# EAGLE design Grove I2C FM Receiver v1.0 (EAGLE 6.4)
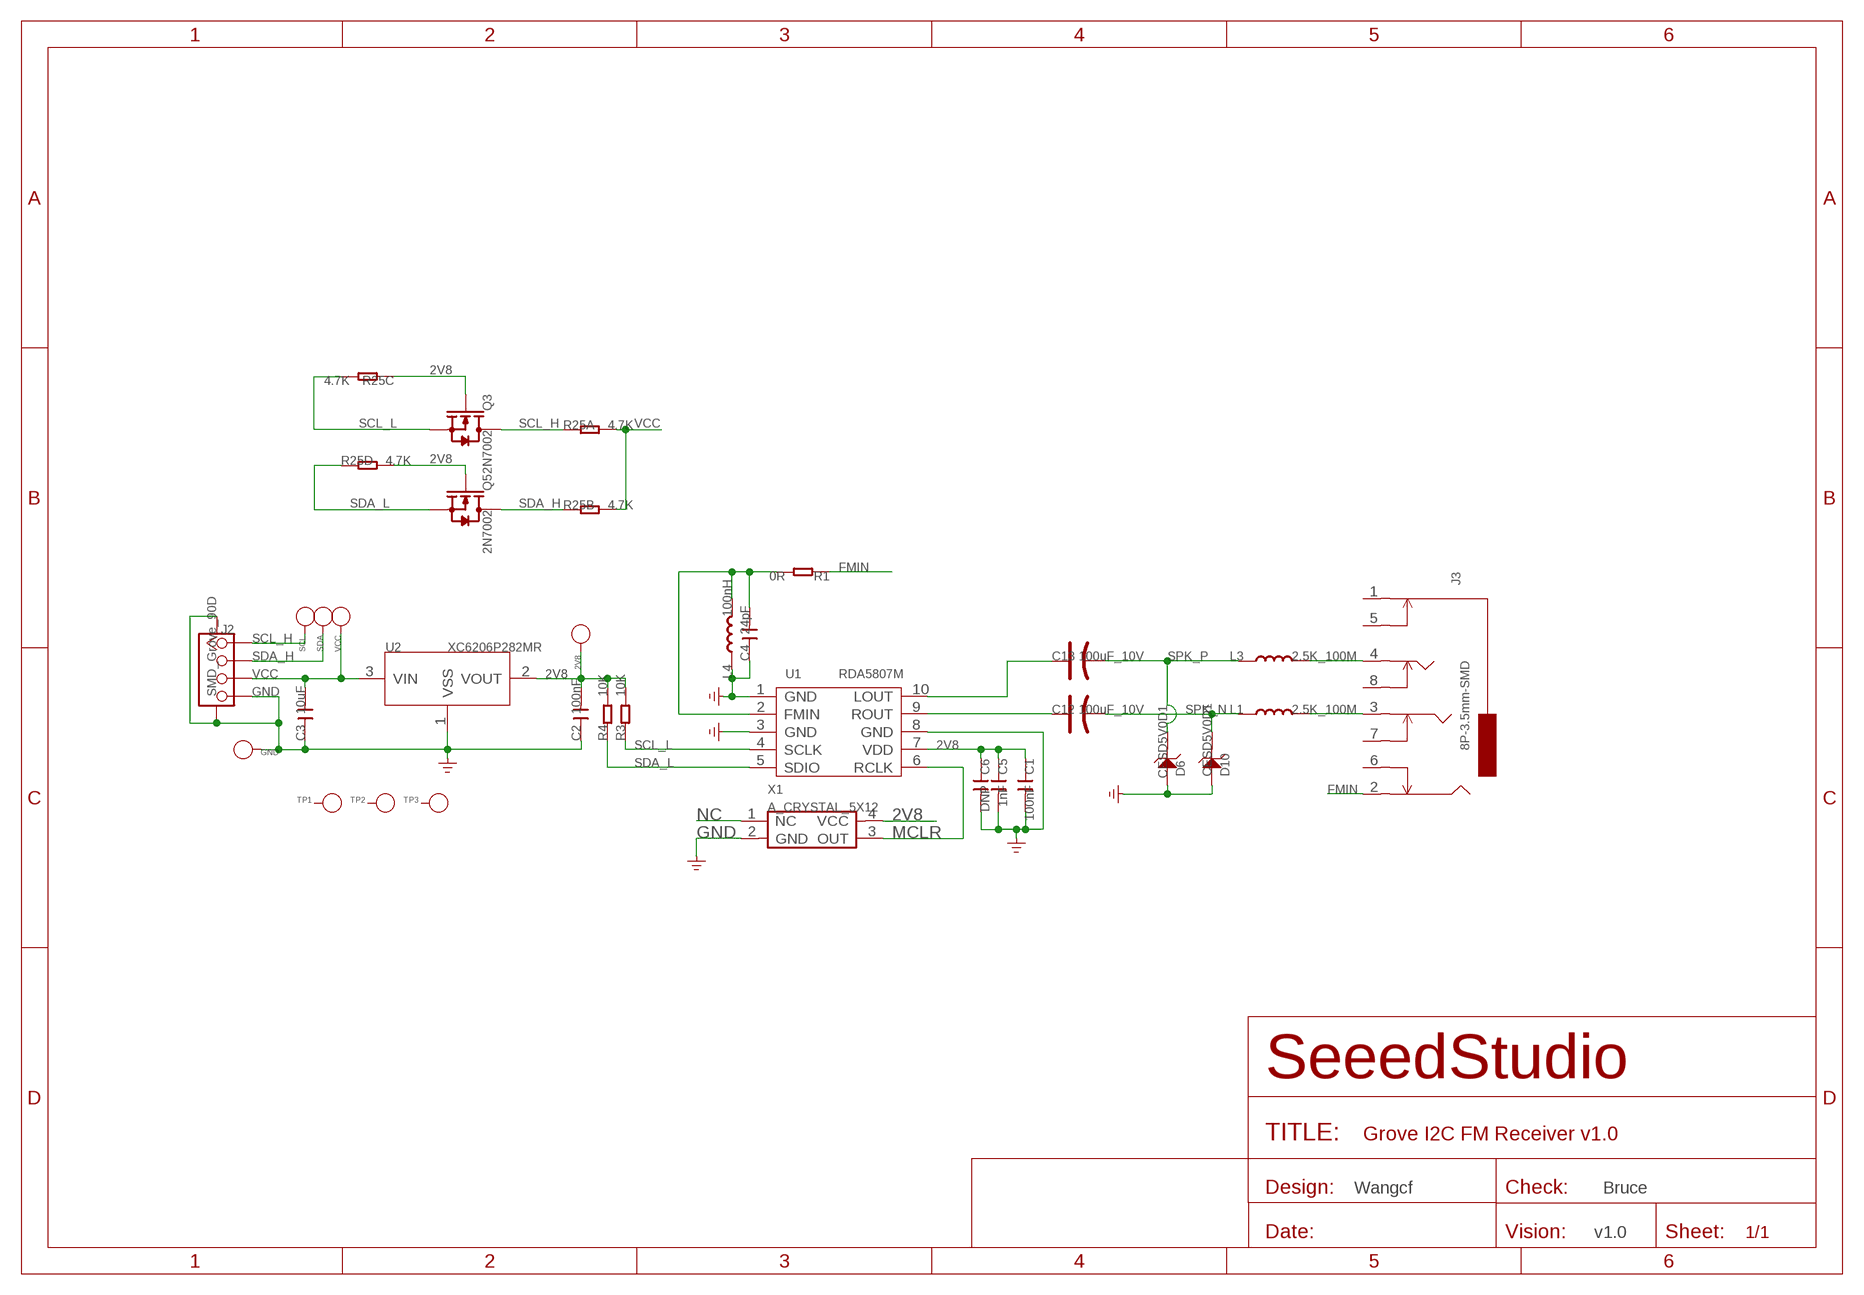
[diagram p0: schematic, sheet 1]

## Parts
2V8  PAD-TEST-POINT'4545'  [TP_4545]
C1  100nF  C-0603  [C0603]
C2  100nF  C-0603  [C0603]
C3  10uF  C-0805  [C0805]
C4  24pF  C-0603  [C0603]
C5  1nF  C-0603  [C0603]
C6  DNP  C-0603  [C0603]
C12  100uF_10V  CAP-AVX-B  [AVX-B]
C13  100uF_10V  CAP-AVX-B  [AVX-B]
D6  CESD5V0D1  D-ESD  [SOD123-2.7X1.6]
D10  CESD5V0D1  D-ESD  [SOD123-2.7X1.6]
GND  PAD-TEST-POINT'4545'  [TP_4545]
J2  SMD_Grove_90D  TWIG-4P-2.0-SMD-FEMALE-REINFORCE'DD'  [4P-SMD-2.0]
J3  8P-3.5mm-SMD  AUDIO-8P'PJ-3536-L6S'  [8P-3.5-SMD]
L1  2.5K_100M  L'0603'  [L0603]
L3  2.5K_100M  L'0603'  [L0603]
L4  100nH  L'0603'  [L0603]
Q3  2N7002  MOSFET-N'SOT23'  [SOT23]
Q5  2N7002  MOSFET-N'SOT23'  [SOT23]
R1  0R  R-0603  [R0603]
R3  10K  R-0603  [R0603]
R4  10K  R-0603  [R0603]
R25  4.7K  R-4R-1206  [1206-8-3.3X2.4]
SCL  PAD-TEST-POINT'4545'  [TP_4545]
SDA  PAD-TEST-POINT'4545'  [TP_4545]
TP1  PAD-TEST-POINT'4545'  [TP_4545]
TP2  PAD-TEST-POINT'4545'  [TP_4545]
TP3  PAD-TEST-POINT'4545'  [TP_4545]
U1  RDA5807M  [MSOP10]
U2  XC6206P282MR  XC6206MR  [SOT23]
VCC  PAD-TEST-POINT'4545'  [TP_4545]
X1  A_CRYSTAL_5X12  [4P_5X12]

## Nets
2V8: 2V8.T C1.1 C2.2 C5.1 C6.1 Q3.1(G) Q5.1(G) R3.2 R4.2 R25.3 R25.5 U1.7(VDD) U2.2(VOUT) X1.4(VCC)
FMIN: J3.2 R1.1
FMIN1: C4.2 L4.2 R1.2 U1.2(FMIN)
GND: C1.2 C2.1 C3.1 C4.1 C5.2 C6.2 D6.1 D10.1 GND.T J2.4 J2.SS1 J2.SS2 L4.1 U1.1(GND) U1.3(GND) U1.8(GND) U2.1(VSS) X1.2(GND)
MCLR: U1.6(RCLK) X1.3(OUT)
N$2: C12.+ U1.9(ROUT)
N$4: C13.+ U1.10(LOUT)
N$5: J3.4 L3.2
N$6: J3.3 L1.2
NC: X1.1(NC)
SCL_H: J2.1 Q3.3(D) R25.1 SCL.T
SCL_L: Q3.2(S) R3.1 R25.6 U1.4(SCLK)
SDA_H: J2.2 Q5.3(D) R25.2 SDA.T
SDA_L: Q5.2(S) R4.1 R25.4 U1.5(SDIO)
SPK_N: C12.- D10.2 L1.1
SPK_P: C13.- D6.2 L3.1
VCC: C3.2 J2.3 R25.7 R25.8 U2.3(VIN) VCC.T
Unconnected: J3.1 J3.5 J3.6 J3.7 J3.8 TP1.T TP2.T TP3.T

## Notes on the sheet
- Wangcf | Bruce
- v1.0

## Library data of the parts
2V8 GND SCL SDA TP1-TP3 VCC = Discrete:PAD-TEST-POINT; PARTNO: DNP
C1-C6 = Discrete:C*: Ceramic Capacitors
C12 C13 = Discrete:CAP*: Electrolytic Capacitors,Tantalum Capacitors and Super Capacitors
D6 D10 = template:D-ESD: Diodes for Protectiong against ESD
J2 = Connector :TWIG-4P-2.0-SMD-FEMALE-REINFORCE
J3 = template:AUDIO-8P
L1 L3 L4 = Discrete:L*
Q3 Q5 = Discrete:MOSFET-N: IRLL014: http://www.vishay.com/docs/91319/sihll014.pdf
R1 R3 R4 = Discrete:R*
R25 = Discrete:R-4R*: Resistor Array
U1 = template:RDA5807M: SINGLE-CHIP BROADCAST FM RADIO TUNER
U2 = IC:XC6206: LOW ESR Cap.Compatible Positive Voltage Regulators
X1 = CPT_SMD:A_CRYSTAL

## Net classes
0 default: width 0.152 mm, drill 0.305 mm, clearance 0.152 mm

## Board
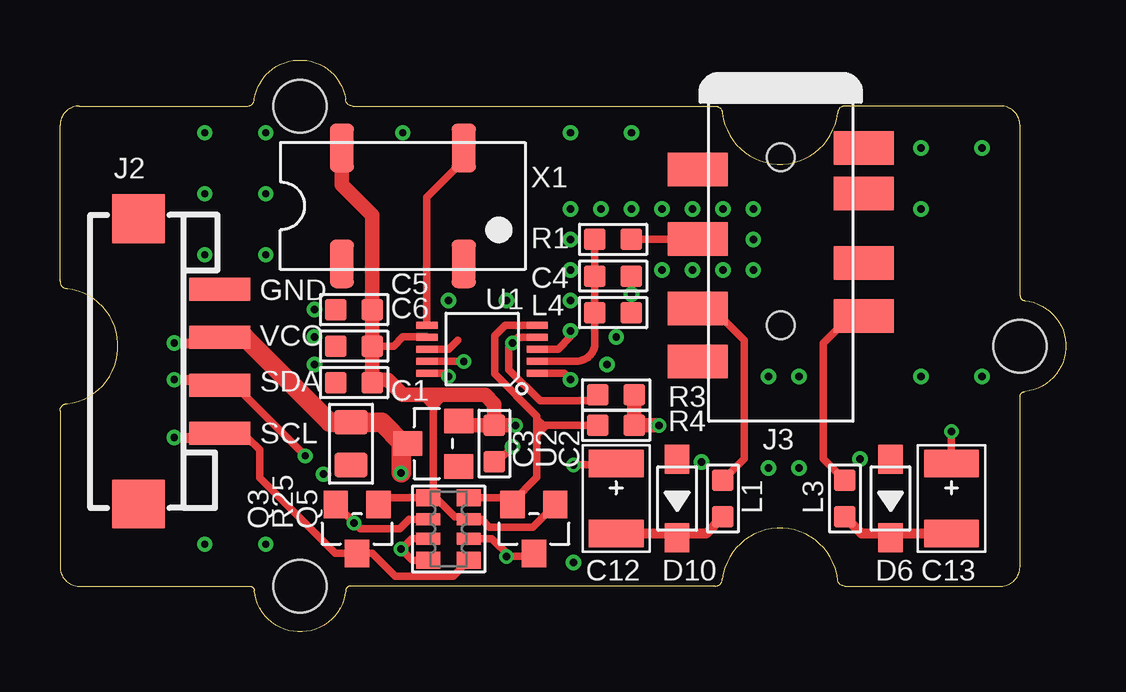
[diagram p1: board, top side]
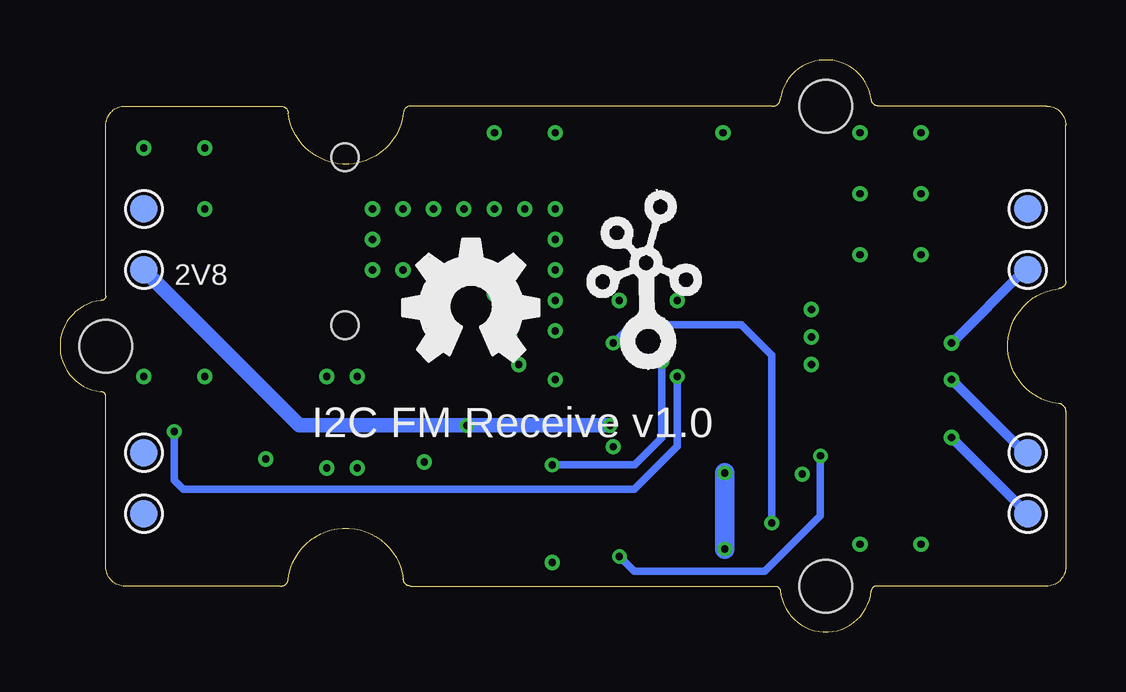
[diagram p2: board, bottom side, seen from below]

Size 41.91 x 23.83 mm. Coordinates in mm from the lower left corner, seen from the top.
Copper layers (1*16): Top 0.035mm / dielectric 1.5mm / Bottom 0.035mm
Design rules "SeeedStudio_DRU_no_angle_20130527 *": minimum track width 6mil, minimum drill 12mil, track to track 6mil, track to pad 6mil, pad to pad 6mil, via to via 6mil, smd to smd 0mil, copper to edge 10mil, drill to drill 10mil, minimum pad ring 10mil, minimum via ring 6mil, stop-mask expansion 2mil, vias tented up to drill 25mil, thermal gap 10mil

### Footprints (pad centres in the part's own frame; a part is rotated, then mirrored left to right if it is on the bottom)
TP_4545 = smd 1.143 x 1.143: T 0,0
C0603 = smd 0.889 x 0.889: 1 -0.762,0; 2 0.762,0
C0805 = smd 1.016 x 1.397: 1 -0.889,0; 2 0.889,0
AVX-B = smd 1.143 x 2.286: + -1.46,0; - 1.46,0
SOD123-2.7X1.6 = smd 1.2 x 1.02: 1 -1.635,0; 2 1.635,0
4P-SMD-2.0 = smd 0.965 x 2.54: 1 -3,0; 2 -1,0; 3 1,0; 4 3,0 | smd 2.032 x 2.184: SS1 -5.946,3.4; SS2 5.946,3.4
8P-3.5-SMD = smd 1.4 x 2.5: 1 2.8,-3.45; 2 5.7,-3.45; 3 8.6,-3.45; 4 8.9,3.45; 5 1.9,3.45; 6 3.8,3.45; 7 6.7,3.45; 8 10.8,-3.45 | hole 1.149: 2.3,0; 9.3,0
L0603 = smd 0.889 x 0.889: 1 -0.762,0; 2 0.762,0
SOT23 = smd 1.016 x 1.143: 1 -0.889,-1.016; 2 0.889,-1.016; 3 0,1.016
R0603 = smd 0.889 x 0.889: 1 -0.762,0; 2 0.762,0
1206-8-3.3X2.4 = smd 0.7 x 1: 1 -1.3,-0.85; 4 1.3,-0.85; 5 1.3,0.85; 8 -1.3,0.85 | smd 0.5 x 1: 2 -0.4,-0.85; 3 0.4,-0.85; 6 0.4,0.85; 7 -0.4,0.85
MSOP10 = smd 0.305 x 0.889: 1 -1,-2.3; 2 -0.5,-2.3; 3 0,-2.3; 4 0.5,-2.3; 5 1,-2.3; 6 1,2.3; 7 0.5,2.3; 8 0,2.3; 9 -0.5,2.3; 10 -1,2.3
SOT23' = smd 1.016 x 1.2: 1 -0.95,-1.06; 2 0.95,-1.06; 3 0,1.06
GROVE-TEST-PLATFORM = hole 2.2: -10,-10; -10,10; 20,0
4P_5X12 = smd 1.016 x 2.032: 1 -2.54,-2.413; 2 2.54,-2.413; 3 2.54,2.413; 4 -2.54,2.413

### Placement (x,y rotation side)
2V8  38.41,15.08 180 bottom
C1  12.25,10.38 180 top
C2  18.09,7.84 90 top
C3  12.13,7.84 90 top
C4  23.05,14.83 180 top
C5  12.25,13.43 180 top
C6  12.25,11.91 180 top
C12  23.18,5.56 270 top
C13  37.14,5.56 270 top
D6  34.61,5.56 270 top
D10  25.71,5.56 270 top
GND  1.59,17.62 180 bottom
J2  6.66,11.27 90 top
J3  30.03,22.07 270 top
L1  27.62,5.56 90 top
L3  32.7,5.56 90 top
L4  23.05,13.31 180 top
Q3  12.38,4.29 180 top
Q5  19.75,4.29 180 top
R1  23.05,16.35 180 top
R3  23.18,9.88 0 top
R4  23.18,8.61 0 top
R25  16.19,4.29 90 top
SCL  1.59,4.92 180 bottom
SDA  1.59,7.46 180 bottom
TP1  38.41,17.62 0 bottom
TP2  38.41,7.46 0 bottom
TP3  38.41,4.92 0 bottom
U1  17.59,11.78 90 top
U2  XC6206P282MR  [SOT23']  15.55,7.84 90 top
U$6  [GROVE-TEST-PLATFORM]  20,11.91 0 top
U$7  [OSHW_FILLX200_NOTEXT]  27.62,11.27 0 bottom
U$11  [TWIGLOGO]  17.46,11.91 0 bottom
VCC  1.59,15.08 180 bottom
X1  14.29,17.75 0 top

### Tracks (layer width: path | path; a pad name or v marks a point on that pad's centre or on a via)
2V8  (via drill 0.3 pad 0.61)
  Top 0.305: R25.5 15.65,5.59 16.44,4.8 16.93,4.8 R25.3 17.57,4.69 17.89,4.36 19.7,4.36 Q5.1 | C6.1 13.9,11.91 14.29,12.29 15.28,12.29 U1.7 | R25.5 13.55,5.59 Q3.1 | 15.55,9.37 15.55,5.8 R25.5 | 15.55,9.37 15.55,9.88 | 15.55,9.37 15.94,9.75 15.17,9.75 15.55,9.37
  Top 0.61: C1.1 13.02,10.51 | 13.02,10.51 C6.1 C5.1 13.02,17.37 11.74,18.64 X1.4 | C2.2 16.8,8.61 U2.2 | 13.02,10.51 13.65,10.51 14.29,9.88 15.55,9.88 17.71,9.88 18.09,9.5 C2.2 | v24.95,8.61 R4.2 R3.2 | v18.98,8.61 C2.2
  Bottom 0.61: v18.98,8.61 v24.95,8.61 31.94,8.61 2V8.T
FMIN
  Top 0.305: R1.1 26.57,16.35 J3.2
FMIN1
  Top 0.305: U1.2 21.53,11.28 arc90 22.29,12.04 22.29,12.54 22.29,12.67 L4.2 C4.2 | 22.29,15.08 C4.2 | C4.2 R1.2
GND  (via drill 0.3 pad 0.64)
  Top 0.305: U1.1 21,10.78 v21.27,10.51 | U1.3 20.76,11.78 21.27,12.29 v21.27,12.54 | C2.1 18.22,7.08 v18.86,7.72 | U1.8 16.19,11.78 16.57,12.16
  other vias: 29.52,10.64 30.8,10.64 28.89,16.35 28.89,15.08 38.41,10.64 10.98,6.57 10.6,11.15 26.73,7.08 29.52,6.83 30.8,6.83 16.19,13.81 25.08,17.62 23.81,17.62 22.54,17.62 21.27,17.62 21.27,16.35 21.27,15.08 21.27,13.81 23.81,14.07 23.18,12.29 22.79,11.15 28.89,17.62 26.35,17.62 27.62,17.62 25.08,15.08 26.35,15.08 27.62,15.08 6.03,20.8 8.57,20.8 8.57,18.26 6.03,18.26 6.03,3.65 8.57,3.65 21.4,2.89 33.34,7.21 6.03,15.72 8.57,15.72 38.41,20.16 35.88,20.16 21.27,20.8 23.81,20.8 10.6,13.43 18.6,13.81 14.29,20.8 35.88,17.62 35.88,10.64 10.6,12.29
MCLR
  Top 0.305: U1.6 15.29,18.12 16.82,19.66 X1.3
N$2  (via drill 0.3 pad 0.61)
  Top 0.305: U1.9 16.82,11.28 v16.82,11.27 | v21.4,6.96 23.11,6.96 C12.+
  Bottom 0.305: v16.82,11.27 16.82,8.1 17.97,6.96 v21.4,6.96
N$4  (via drill 0.3 pad 0.61)
  Top 0.305: U1.10 16.05,10.78 v16.19,10.64 | v37.14,8.35 C13.+
  Bottom 0.305: v16.19,10.64 16.19,7.74 17.99,5.94 36.76,5.94 37.14,6.32 v37.14,8.35
N$5
  Top 0.305: L3.2 31.81,7.21 31.81,12.04 32.94,13.17 J3.4
N$6
  Top 0.305: L1.2 28.51,7.21 28.51,12.16 27.2,13.47 J3.3
SCL_H  (via drill 0.3 pad 0.64)
  Top 0.305: 6.49,8.1 7.81,8.1 8.32,7.59 8.32,6.42 11.46,3.27 Q3.3 13.02,3.27 13.96,2.33 16.38,2.33 R25.1
  Top 0.406: v4.76,8.1 6.49,8.1 J2.1
  Bottom 0.406: SCL.T v4.76,8.1
SCL_L  (via drill 0.3 pad 0.61)
  Top 0.305: R25.6 14.56,4.69 14.16,4.29 12.51,4.29 v12.25,4.54 Q3.2 | U1.4 19.1,12.28 v18.86,12.04 18.69,11.87 18.69,10.93 20,9.62 22.16,9.62 R3.1
  Bottom 0.305: v12.25,4.54 12.25,11.53 13.52,12.8 18.09,12.8 v18.86,12.04
SDA_H  (via drill 0.3 pad 0.61, 0.3 pad 0.64)
  Top 0.305: J2.2 7.28,10.27 v10.22,7.34 | v18.6,3.15 18.73,3.15 | 18.73,3.15 19.62,3.15 Q5.3 | R25.2 17.99,3.89 18.73,3.15
  Top 0.406: v4.76,10.51 6.43,10.51 J2.2
  Bottom 0.305: v10.22,7.34 10.22,4.85 12.54,2.53 17.98,2.53 v18.6,3.15
  Bottom 0.406: SDA.T 1.71,7.46 v4.76,10.51
SDA_L
  Top 0.305: R25.4 18.57,5.59 Q5.2 18.86,5.43 19.87,6.45 19.87,8.23 | U1.5 18.55,12.78 18.11,12.34 18.11,10.75 19.87,8.99 19.87,8.86 | 19.87,8.86 19.87,8.61 | 19.87,8.61 19.87,8.23 | R4.1 20.25,8.61 | 20.13,8.61 19.87,8.61 | 19.87,8.23 20.25,8.61 | 20.25,8.61 20.13,8.61 | 20.13,8.61 19.87,8.86
SPK_N
  Top 0.406: L1.1 26.92,4.1 25.89,4.1 | 25.89,4.1 D10.2 | 25.89,4.1 C12.-
SPK_P
  Top 0.406: C13.- 34.78,4.1 | 34.78,4.1 D6.2 | 34.78,4.1 33.4,4.1 L3.1
VCC  (via drill 0.3 pad 0.61, 0.3 pad 0.64)
  Top 0.305: R25.7 14.65,3.89 v14.21,3.45 14.67,2.99 R25.8
  Top 0.406: v4.76,12.04 6.43,12.04 J2.3
  Top 0.813: U2.3 14.36,7.84 | 14.36,7.84 14.29,7.84 13.4,8.73 C3.2 11.24,8.73 7.7,12.27 J2.3 | v14.21,6.63 14.21,7.69 14.36,7.84
  Bottom 0.406: VCC.T 1.71,15.08 v4.76,12.04
  Bottom 0.813: v14.21,3.45 v14.21,6.63

### Text on the board
tPlace: GND | VCC | SDA | SCL
bPlace: I2C FM Receive v1.0
bNames: 2V8